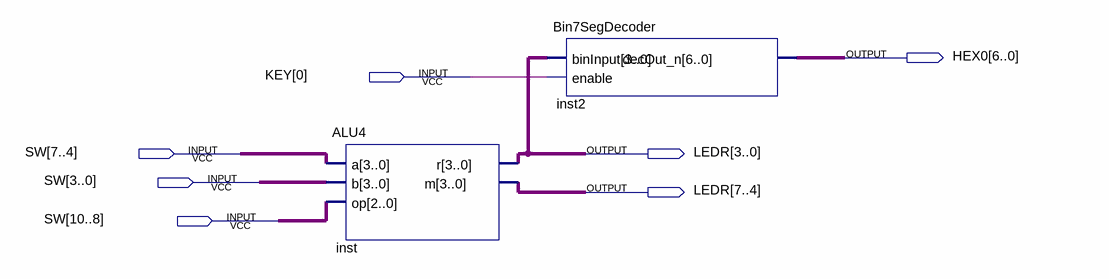
[diagram p0: schematic sheet]
// Quartus schematic HexDemo.bdf as structural Verilog: 2 symbols, 7 pins
module HexDemo (
  input  [0:0] KEY,
  input  [10:0] SW,
  output [6:0] HEX0,
  output [7:0] LEDR
);

  ALU4 inst (.a(SW[7:4]), .b(SW[3:0]), .op(SW[10:8]), .r(LEDR[3:0]), .m(LEDR[7:4]));
  Bin7SegDecoder inst2 (.binInput(LEDR[3:0]), .enable(KEY[0]), .decOut_n(HEX0));
endmodule
